# Altium schematic sheet SPLITTER.SchDoc
size Letter; DrawnBy: Titan Yuan; SheetNumber: 2; SheetTotal: 9
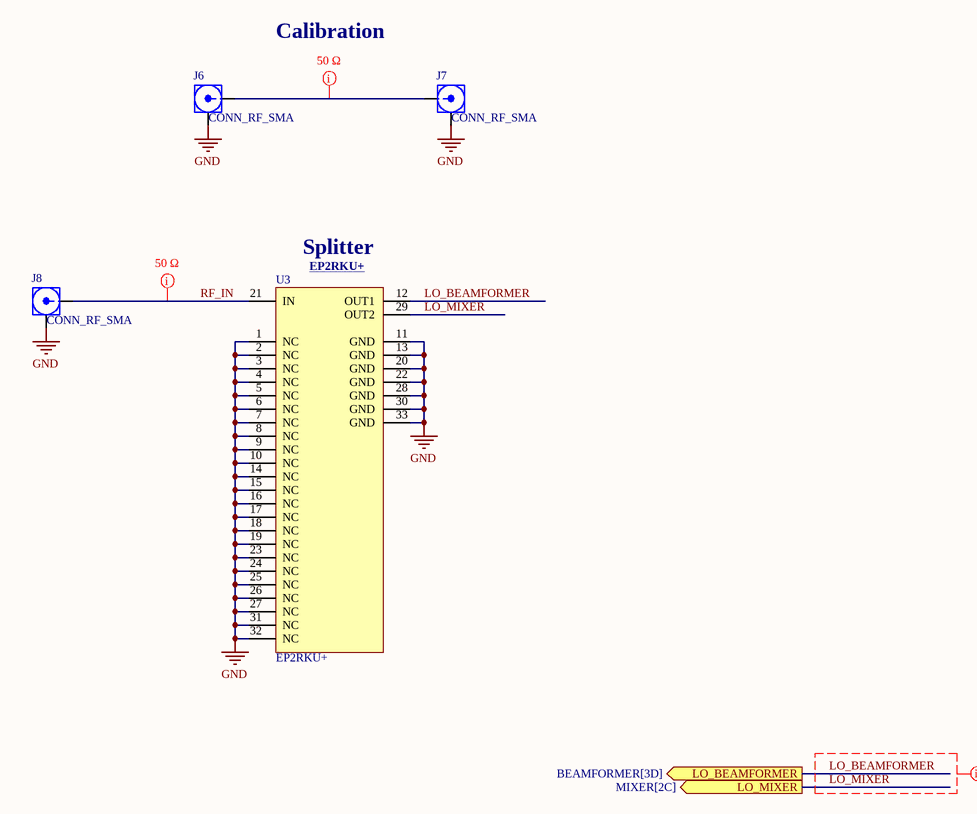
[diagram p0: SPLITTER.SchDoc]

## Parts
J6  CONN_RF_SMA  [142-0701-801]
J7  CONN_RF_SMA  [142-0701-801]
J8  CONN_RF_SMA  [142-0701-801]
U3  EP2RKU+  [PL-648]

## Ports
LO_BEAMFORMER (out, see BEAMFORMER[3D]), LO_MIXER (out, see MIXER[2C])

## Nets
GND: J6.2 J7.2 J8.2 U3.1(NC) U3.2(NC) U3.3(NC) U3.4(NC) U3.5(NC) U3.6(NC) U3.7(NC) U3.8(NC) U3.9(NC) U3.10(NC) U3.11(GND) U3.13(GND) U3.14(NC) U3.15(NC) U3.16(NC) U3.17(NC) U3.18(NC) U3.19(NC) U3.20(GND) U3.22(GND) U3.23(NC) U3.24(NC) U3.25(NC) U3.26(NC) U3.27(NC) U3.28(GND) U3.30(GND) U3.31(NC) U3.32(NC) U3.33(GND)
LO_BEAMFORMER: U3.12(OUT1) ; port LO_BEAMFORMER
LO_MIXER: U3.29(OUT2) ; port LO_MIXER
RF_IN: J8.1 U3.21(IN)
NetJ6_1: J6.1 J7.1

## Layout directives
net class 50 Ω: LO_BEAMFORMER, LO_MIXER, NetJ6_1, RF_IN

## Notes on the sheet
- Calibration
- (near U3) Splitter
- (near U3) EP2RKU+ <https://www.minicircuits.com/WebStore/dashboard.html?model=EP2RKU%2B>

## Library data of the parts
J6-J8 = CONN_RF_SMA: RF / Coaxial Connector, SMA Coaxial, Straight Jack, Solder, 50 ohm, Beryllium Copper; Manufacturer: Cinch Connectivity Solutions Johnson; Maximum Frequency: 18 GHz; Body Material: Brass; Body Plating: Gold; Connector Type: Coaxial, PCB, SMA, Socket; Contact Resistance: 4mΩ; Dielectric Material: PTFE; Frequency: 18GHz; Gender: Female; Impedance: 50Ω; Insulation Resistance: 5GΩ; Number of Contacts: 1; Polarity: Normal; Voltage Rating: 335V; Manufacturer Part Number: 142-0701-801; Supplier: DigiKey; Supplier Part Number: J502-ND; RoHS: Compliant; Category: RF / Coaxial Connectors; Stock: 35108; Pricing: 1=3.73, 10=3.166, 25=2.9676, 50=2.826, 100=2.691, 250=2.52244, 500=2.40206, 1000=2.28748, 2500=2.1444 (USD); Case/Package: SMA; Contact Gender: Female; Contact Material: Gold, Nickel; Contact Plating: Gold; Depth: 25.58mm; Export Control Classification Number (ECCN) Code: EAR99; Fastening Type: Threaded; Height: 9.779mm; Housing Color: Gold; Housing Material: Brass; Harmonized Tariff Schedule (HTS) Code: 8536.69.40.10; Insulation Material: PTFE; Introduction Date: 1994-06-01; Lead Free: Lead Free; Length: 9.52mm; Lifecycle Status: Production; Clock Frequency: 18GHz; Max Operating Temperature: 165°C; Min Operating Temperature: -65°C; Mounting Technology: Edge, PCB; Pins: 1; Number of Ports: 1; Orientation: Straight; Radiation Hardening: No; REACH SVHC: No; Schedule B: 8536695050, 8536695050|8536695050|8536695050|8536695050|8536695050; Shell Material: Brass; Termination: Solder; ComponentLink1URL: https://datasheet.octopart.com:443/142-0701-801-Cinch-Connectors-datasheet-38159423.pdf?src-supplier=element14+APAC; ComponentLink1Description: https://datasheet.octopart.com:443/142-0701-801-Cinch-Connectors-datasheet-38159423.pdf?src-supplier=element14+APAC; ComponentLink2URL: https://datasheet.octopart.com:443/142-0701-801-Cinch-Connectivity-Solutions-datasheet-128878268.pdf?src-supplier=JRH+Electronics; ComponentLink2Description: https://datasheet.octopart.com:443/142-0701-801-Cinch-Connectivity-Solutions-datasheet-128878268.pdf?src-supplier=JRH+Electronics; ComponentLink3URL: https://datasheet.octopart.com:443/142-0701-801-Cinch-Connectivity-Solutions-datasheet-180501451.pdf?src-supplier=IHS; ComponentLink3Description: https://datasheet.octopart.com:443/142-0701-801-Cinch-Connectivity-Solutions-datasheet-180501451.pdf?src-supplier=IHS; ComponentLink4URL: https://datasheet.octopart.com:443/142-0701-801-Cinch-Connectivity-Solutions-datasheet-182240672.pdf?src-supplier=IHS; ComponentLink4Description: https://datasheet.octopart.com:443/142-0701-801-Cinch-Connectivity-Solutions-datasheet-182240672.pdf?src-supplier=IHS; ComponentLink5URL: https://datasheet.octopart.com:443/142-0701-801-Emerson-datasheet-182246267.pdf?src-supplier=IHS; ComponentLink5Description: https://datasheet.octopart.com:443/142-0701-801-Emerson-datasheet-182246267.pdf?src-supplier=IHS; ComponentLink6URL: https://datasheet.octopart.com:443/142-0701-801-Emerson-Network-Power-datasheet-40124.pdf?src-supplier=Newark; ComponentLink6Description: https://datasheet.octopart.com:443/142-0701-801-Emerson-Network-Power-datasheet-40124.pdf?src-supplier=Newark; ComponentLink7URL: https://datasheet.octopart.com:443/142-0701-801-Cinch-Connectors-datasheet-24914353.pdf?src-supplier=Electro+Sonic; ComponentLink7Description: https://datasheet.octopart.com:443/142-0701-801-Cinch-Connectors-datasheet-24914353.pdf?src-supplier=Electro+Sonic; ComponentLink8URL: https://datasheet.octopart.com:443/142-0701-801-Emerson-Network-Power-datasheet-14433785.pdf?src-supplier=Farnell; ComponentLink8Description: https://datasheet.octopart.com:443/142-0701-801-Emerson-Network-Power-datasheet-14433785.pdf?src-supplier=Farnell; ComponentLink9URL: https://datasheet.octopart.com:443/142-0701-801-Emerson-Network-Power-datasheet-8828422.pdf?src-supplier=Farnell; ComponentLink9Description: https://datasheet.octopart.com:443/142-0701-801-Emerson-Network-Power-datasheet-8828422.pdf?src-supplier=Farnell; ComponentLink10URL: https://datasheet.octopart.com:443/142-0701-801-Emerson-Network-Power-datasheet-10031126.pdf?src-supplier=Farnell; ComponentLink10Description: https://datasheet.octopart.com:443/142-0701-801-Emerson-Network-Power-datasheet-10031126.pdf?src-supplier=Farnell; ComponentLink11URL: https://datasheet.octopart.com:443/142-0701-801-Emerson-Network-Power-datasheet-47159.pdf?src-supplier=Farnell; ComponentLink11Description: https://datasheet.octopart.com:443/142-0701-801-Emerson-Network-Power-datasheet-47159.pdf?src-supplier=Farnell; ComponentLink12URL: https://datasheet.octopart.com:443/142-0701-801-Emerson-Network-Power-datasheet-29036.pdf?src-supplier=Farnell; ComponentLink12Description: https://datasheet.octopart.com:443/142-0701-801-Emerson-Network-Power-datasheet-29036.pdf?src-supplier=Farnell; ComponentLink13URL: https://datasheet.octopart.com:443/142-0701-801-Semflex-datasheet-33021794.pdf?src-supplier=East+Coast+Microwave; ComponentLink13Description: https://datasheet.octopart.com:443/142-0701-801-Semflex-datasheet-33021794.pdf?src-supplier=East+Coast+Microwave; ComponentLink14URL: https://datasheet.octopart.com:443/142-0701-801-Emerson-datasheet-31818286.pdf?src-supplier=East+Coast+Microwave; ComponentLink14Description: https://datasheet.octopart.com:443/142-0701-801-Emerson-datasheet-31818286.pdf?src-supplier=East+Coast+Microwave; ComponentLink15URL: https://datasheet.octopart.com:443/142-0701-801-Cinch-Connectors-datasheet-27682.pdf?src-supplier=RS+(Formerly+Allied+Electronics); ComponentLink15Description: https://datasheet.octopart.com:443/142-0701-801-Cinch-Connectors-datasheet-27682.pdf?src-supplier=RS+(Formerly+Allied+Electronics); ComponentLink16URL: https://datasheet.octopart.com:443/142-0701-801-Emerson-Network-Power-datasheet-644257.pdf?src-supplier=Future+Electronics; ComponentLink16Description: https://datasheet.octopart.com:443/142-0701-801-Emerson-Network-Power-datasheet-644257.pdf?src-supplier=Future+Electronics; ComponentLink17URL: https://datasheet.octopart.com:443/142-0701-801-Emerson-Network-Power-datasheet-55164.pdf?src-supplier=_legacy+Avnet; ComponentLink17Description: https://datasheet.octopart.com:443/142-0701-801-Emerson-Network-Power-datasheet-55164.pdf?src-supplier=_legacy+Avnet
U3 = EP2RKU+: Splitter And Combiner, 0MHz Min, 18000MHz Max, 3.9dB Insertion Loss-Max, GAAS; Manufacturer: Mini-Circuits; Bandwidth: 18GHz; Impedance: 50Ω; Manufacturer Part Number: EP2RKU+; Supplier: DigiKey; Supplier Part Number: 3157-EP2RKU+CT-ND; RoHS: Compliant; Category: NFC / RFID Components; Stock: 2201; Pricing: 1=37.19, 20=30.288, 50=29.9268 (USD); Height: 1mm; Insertion Loss (dB): 3.9dB; Lifecycle Status: Production; Clock Frequency: 18GHz; Max Operating Temperature: 105°C; Min Operating Temperature: -55°C; Mounting Technology: Surface Mount; Number of Terminals: 32; ComponentLink1URL: https://datasheet.octopart.com:443/EP2RKU%2B-Mini-Circuits-datasheet-180700603.pdf?src-supplier=IHS; ComponentLink1Description: https://datasheet.octopart.com:443/EP2RKU%2B-Mini-Circuits-datasheet-180700603.pdf?src-supplier=IHS; ComponentLink2URL: https://datasheet.octopart.com:443/EP2RKU%2B-Mini-Circuits-datasheet-140829873.pdf?src-supplier=Upverter; ComponentLink2Description: https://datasheet.octopart.com:443/EP2RKU%2B-Mini-Circuits-datasheet-140829873.pdf?src-supplier=Upverter; ComponentLink3URL: https://sigma.octopart.com:443/139591504/technical_drawing/Mini-Circuits-EP2RKU%2B.pdf?src-supplier=Upverter; ComponentLink3Description: https://sigma.octopart.com:443/139591504/technical_drawing/Mini-Circuits-EP2RKU%2B.pdf?src-supplier=Upverter